# Altium project ESP_PCB.PrjPcb
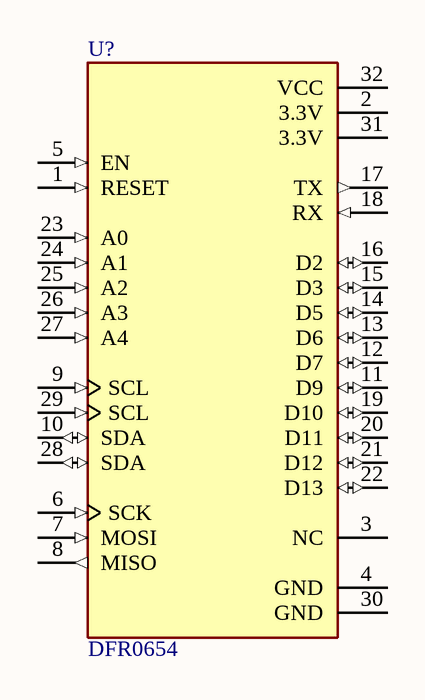
[diagram p0: ESP_PCB.SchDoc]
1 sheet, 1 parts. Net scope: global (net labels, ports and power ports of the same name join across sheets).
Board file: PCB2.PcbDoc

## Sheet ESP_PCB.SchDoc
size A4; SheetNumber: 1; SheetTotal: 1

### Parts
U?  DFR0654  [MODULE_DFR0654]

### Nets

Not connected (* = marked no-connect by the designer): U? 1(RESET) 2(3.3V) 3(NC) 4(GND) 5(EN) 6(SCK) 7(MOSI) 8(MISO) 9(SCL) 10(SDA) 11(D9) 12(D7) 13(D6) 14(D5) 15(D3) 16(D2) 17(TX) 18(RX) 19(D10) 20(D11) 21(D12) 22(D13) 23(A0) 24(A1) 25(A2) 26(A3) 27(A4) 28(SDA) 29(SCL) 30(GND) 31(3.3V) 32(VCC)

### Library data of the parts
U? = DFR0654: ESP32-E ESP32 Transceiver; 802.11 b/g/n/d/e/i/k/r (Wi-Fi, WiFi, WLAN), BluetoothÂ® Smart 4.x Low Energy (BLE) 2.4GHz ~ 2.5GHz Evaluation Board; MF: DFRobot; SnapEDA_Link: https://www.snapeda.com/parts/DFR0654/DFRobot/view-part/?ref=snap; Package: None; Value: *; MP: DFR0654; Check_prices: https://www.snapeda.com/parts/DFR0654/DFRobot/view-part/?ref=eda